# Altium project GameBoard_V1I1.PrjPcb (part 15 of 20)

## Sheet [24] - HEADERS, UART.SchDoc
size A2; DocumentNumber: 24; SheetNumber: 24; SheetTotal: 32
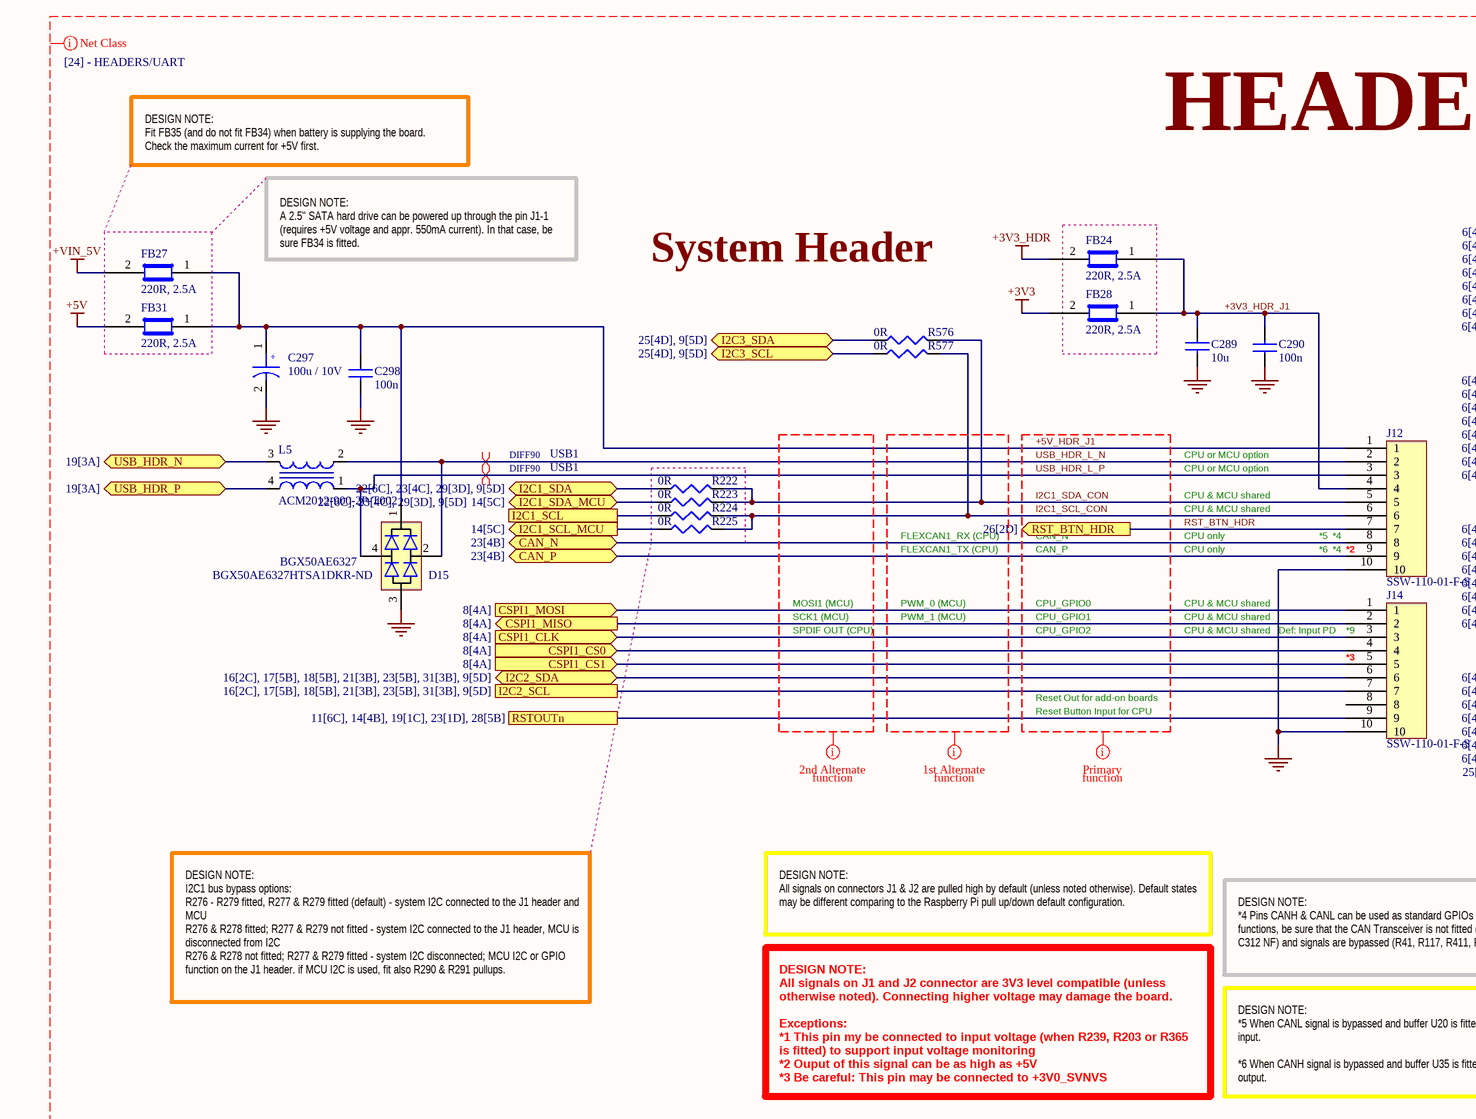
[diagram p78: [24] - HEADERS, UART.SchDoc, top left]
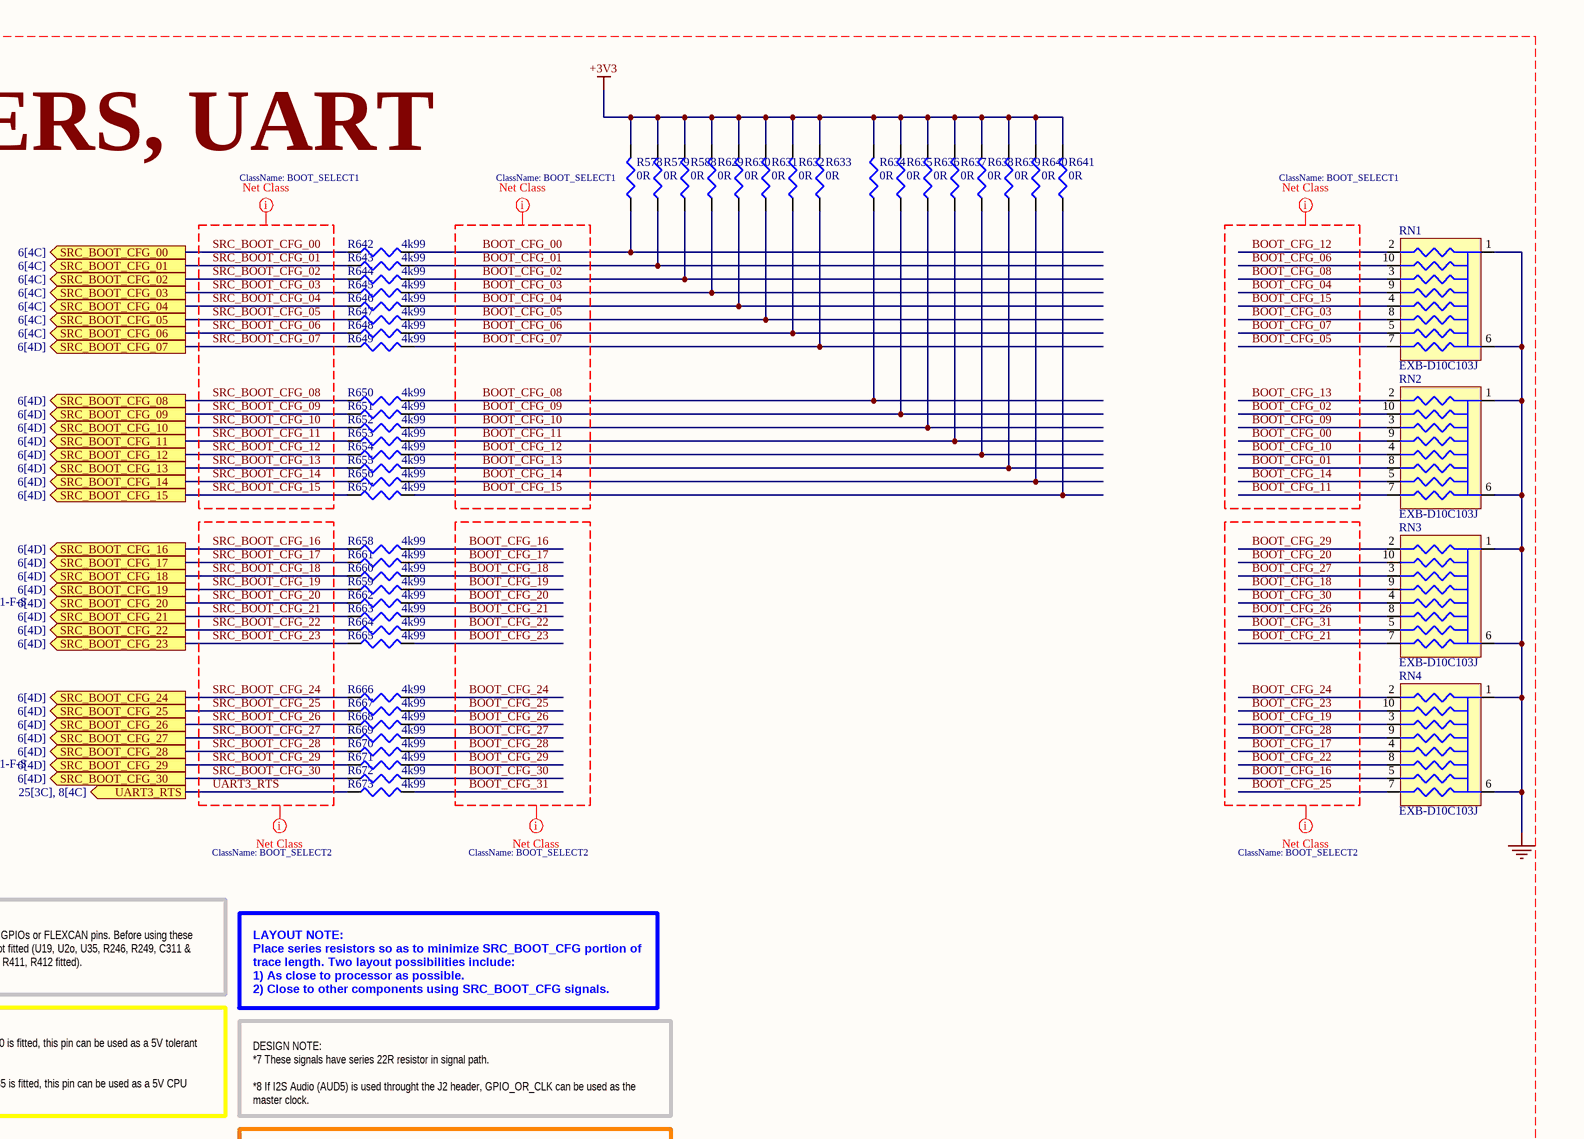
[diagram p79: [24] - HEADERS, UART.SchDoc, top right]
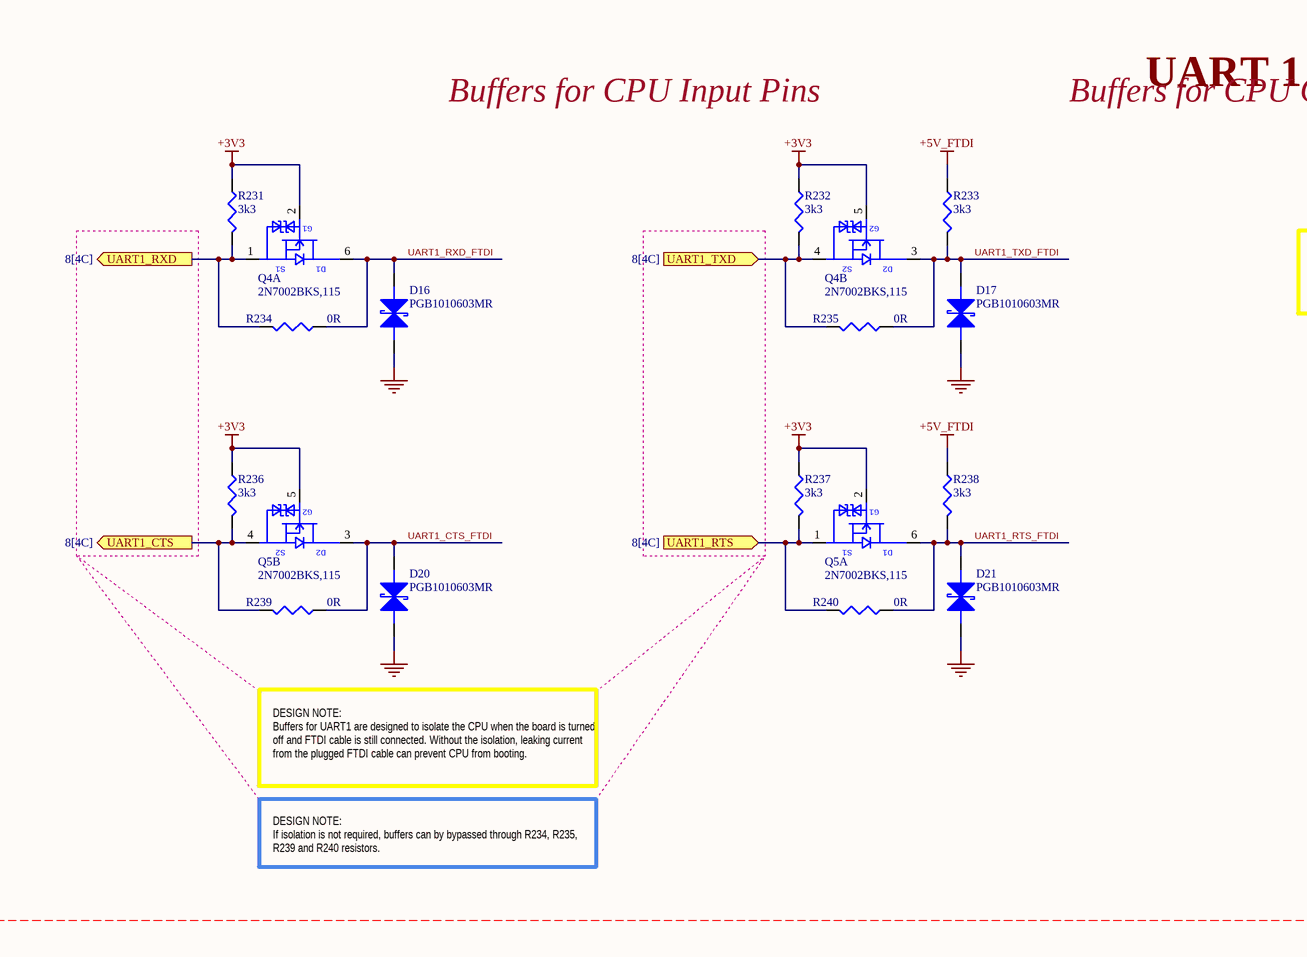
[diagram p80: [24] - HEADERS, UART.SchDoc, bottom left]
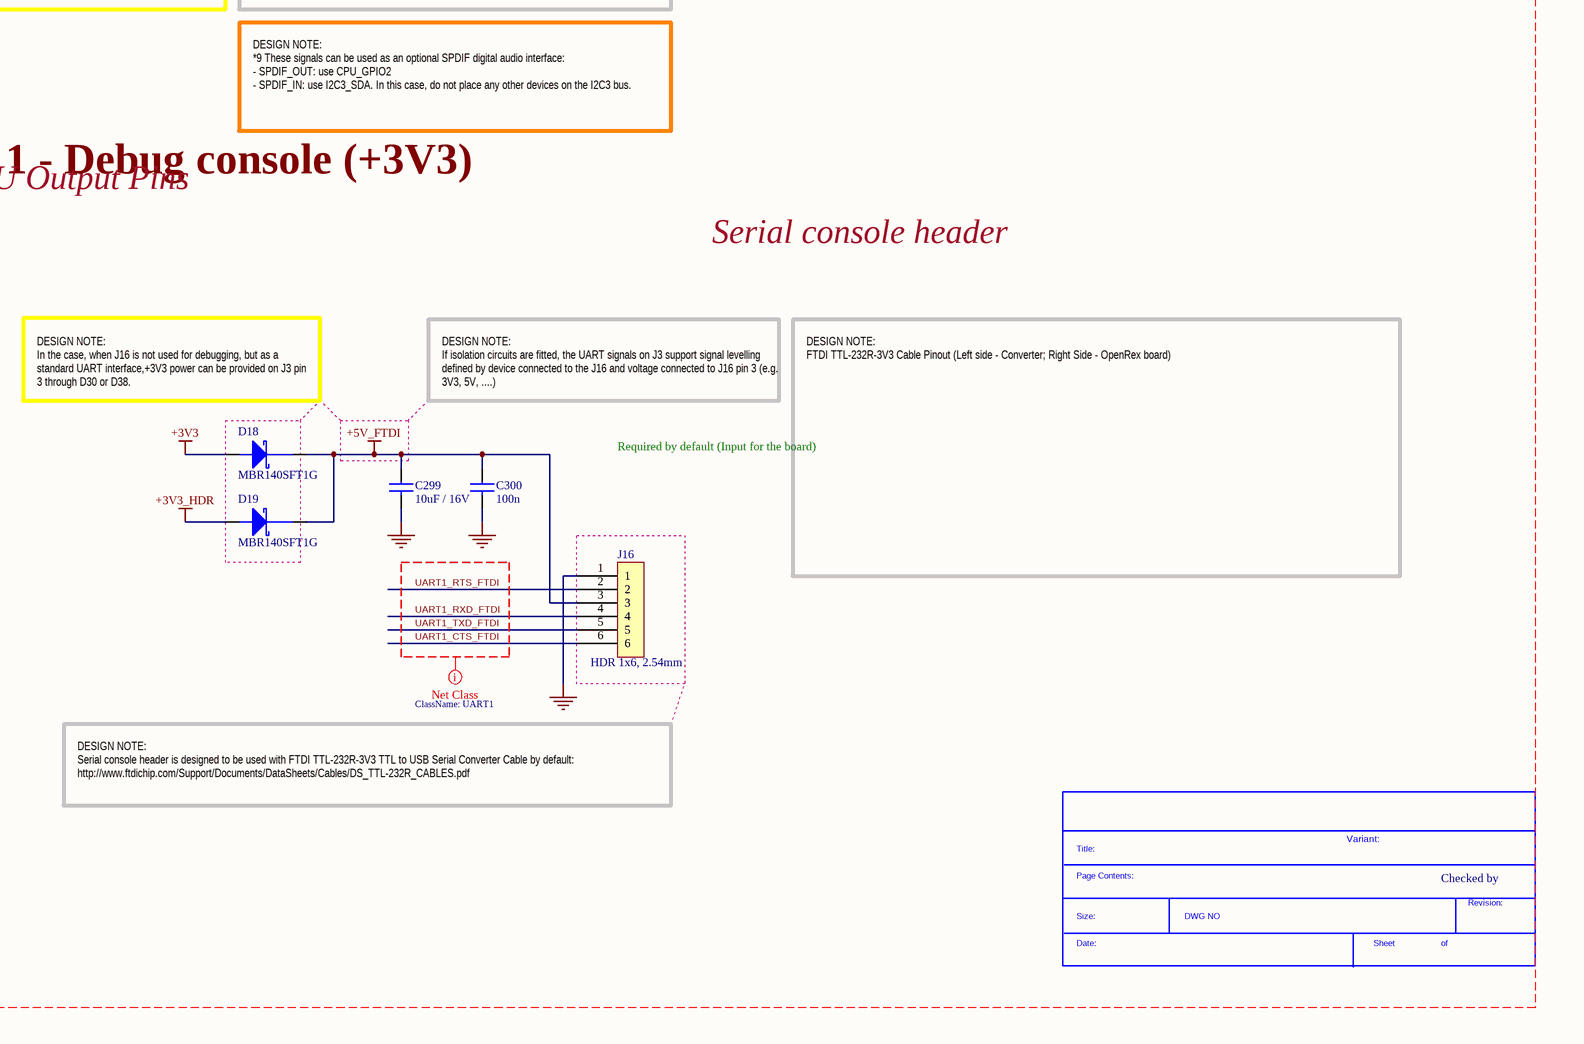
[diagram p81: [24] - HEADERS, UART.SchDoc, bottom right]

### Parts
(Parts that share a designator on the sheet are numbered #1, #2 ... from top to bottom, then left to right.)
*#27  SDTitleBlock  (value not drawn)  (graphical)
C289  10u  [C0603]
C290  100n  [C0402]
C297  100u / 10V  [C2312]
C298  100n  [C0402]
C299  10uF / 16V  [C0805]
C300  100n  [C0402]
D15  BGX50AE6327  Supplier Part Number 1: BGX50AE6327HTSA1DKR-ND  [SOT143]
D16  PGB1010603MR  [C0603]
D17  PGB1010603MR  [C0603]
D18  MBR140SFT1G  [SOD-123FL]
D19  MBR140SFT1G  [SOD-123FL]
D20  PGB1010603MR  [C0603]
D21  PGB1010603MR  [C0603]
FB24  220R, 2.5A  [C0603]
FB27  220R, 2.5A  [C0603]
FB28  220R, 2.5A  [C0603]
FB31  220R, 2.5A  [C0603]
J12  SSW-110-01-F-S  [SSW-110-01-F-S]
J14  SSW-110-01-F-S  [SSW-110-01-F-S]
J16  HDR 1x6, 2.54mm  [Hdr_1x6_2.54mm]
L5  ACM2012-900-2P-T002  [ACM2012]
Q4  2N7002BKS,115  [SOT363]  (parts A,B of 2)
Q5  2N7002BKS,115  [SOT363]  (parts A,B of 2)
R222  0R  [R0402]
R223  0R  [R0402]
R224  0R  [R0402]
R225  0R  [R0402]
R231  3k3  [R0402]
R232  3k3  [R0402]
R233  3k3  [R0402]
R234  0R  [R0402]
R235  0R  [R0402]
R236  3k3  [R0402]
R237  3k3  [R0402]
R238  3k3  [R0402]
R239  0R  [R0402]
R240  0R  [R0402]
R576  0R  [R0402]
R577  0R  [R0402]
R578  0R  [R0402]
R579  0R  [R0402]
R588  0R  [R0402]
R629  0R  [R0402]
R630  0R  [R0402]
R631  0R  [R0402]
R632  0R  [R0402]
R633  0R  [R0402]
R634  0R  [R0402]
R635  0R  [R0402]
R636  0R  [R0402]
R637  0R  [R0402]
R638  0R  [R0402]
R639  0R  [R0402]
R640  0R  [R0402]
R641  0R  [R0402]
R642  4k99  [R0201]
R643  4k99  [R0201]
R644  4k99  [R0201]
R645  4k99  [R0201]
R646  4k99  [R0201]
R647  4k99  [R0201]
R648  4k99  [R0201]
R649  4k99  [R0201]
R650  4k99  [R0201]
R651  4k99  [R0201]
R652  4k99  [R0201]
R653  4k99  [R0201]
R654  4k99  [R0201]
R655  4k99  [R0201]
R656  4k99  [R0201]
R657  4k99  [R0201]
R658  4k99  [R0201]
R659  4k99  [R0201]
R660  4k99  [R0201]
R661  4k99  [R0201]
R662  4k99  [R0201]
R663  4k99  [R0201]
R664  4k99  [R0201]
R665  4k99  [R0201]
R666  4k99  [R0201]
R667  4k99  [R0201]
R668  4k99  [R0201]
R669  4k99  [R0201]
R670  4k99  [R0201]
R671  4k99  [R0201]
R672  4k99  [R0201]
R673  4k99  [R0201]
RN1  EXB-D10C103J  [EXB-D10C103J]
RN2  EXB-D10C103J  [EXB-D10C103J]
RN3  EXB-D10C103J  [EXB-D10C103J]
RN4  EXB-D10C103J  [EXB-D10C103J]

### Ports
CAN_N (bidir, see 23[4B]), CAN_P (bidir, see 23[4B]), CSPI1_CLK (in, see 8[4A]), CSPI1_CS0 (in, see 8[4A]), CSPI1_CS1 (in, see 8[4A]), CSPI1_MISO (out, see 8[4A]), CSPI1_MOSI (in, see 8[4A]), I2C1_SCL (see 22[6C], 23[4C], 29[3D], 9[5D]), I2C1_SCL_MCU (out, see 14[5C]), I2C1_SDA (bidir, see 22[6C], 23[4C], 29[3D], 9[5D]), I2C1_SDA_MCU (bidir, see 14[5C]), I2C2_SCL (see 16[2C], 17[5B], 18[5B], 21[3B], 23[5B], 31[3B], 9[5D]), I2C2_SDA (bidir, see 16[2C], 17[5B], 18[5B], 21[3B], 23[5B], 31[3B], 9[5D]), I2C3_SCL (bidir, see 25[4D], 9[5D]), I2C3_SDA (bidir, see 25[4D], 9[5D]), RST_BTN_HDR (out, see 26[2D]), RSTOUTn (see 11[6C], 14[4B], 19[1C], 23[1D], 28[5B]), SRC_BOOT_CFG_00 (out, see 6[4C]), SRC_BOOT_CFG_01 (out, see 6[4C]), SRC_BOOT_CFG_02 (out, see 6[4C]), SRC_BOOT_CFG_03 (out, see 6[4C]), SRC_BOOT_CFG_04 (out, see 6[4C]), SRC_BOOT_CFG_05 (out, see 6[4C]), SRC_BOOT_CFG_06 (out, see 6[4C]), SRC_BOOT_CFG_07 (out, see 6[4D]), SRC_BOOT_CFG_08 (out, see 6[4D]), SRC_BOOT_CFG_09 (out, see 6[4D]), SRC_BOOT_CFG_10 (out, see 6[4D]), SRC_BOOT_CFG_11 (out, see 6[4D]), SRC_BOOT_CFG_12 (out, see 6[4D]), SRC_BOOT_CFG_13 (out, see 6[4D]), SRC_BOOT_CFG_14 (out, see 6[4D]), SRC_BOOT_CFG_15 (out, see 6[4D]), SRC_BOOT_CFG_16 (out, see 6[4D]), SRC_BOOT_CFG_17 (out, see 6[4D]), SRC_BOOT_CFG_18 (out, see 6[4D]), SRC_BOOT_CFG_19 (out, see 6[4D]), SRC_BOOT_CFG_20 (out, see 6[4D]), SRC_BOOT_CFG_21 (out, see 6[4D]), SRC_BOOT_CFG_22 (out, see 6[4D]), SRC_BOOT_CFG_23 (out, see 6[4D]), SRC_BOOT_CFG_24 (out, see 6[4D]), SRC_BOOT_CFG_25 (out, see 6[4D]), SRC_BOOT_CFG_26 (out, see 6[4D]), SRC_BOOT_CFG_27 (out, see 6[4D]), SRC_BOOT_CFG_28 (out, see 6[4D]), SRC_BOOT_CFG_29 (out, see 6[4D]), SRC_BOOT_CFG_30 (out, see 6[4D]), UART1_CTS (out, see 8[4C]), UART1_RTS (in, see 8[4C]), UART1_RXD (out, see 8[4C]), UART1_TXD (in, see 8[4C]), UART3_RTS (out, see 25[3C], 8[4C]), USB_HDR_N (bidir, see 19[3A]), USB_HDR_P (bidir, see 19[3A])

### Nets
+3V3: D18.2(Anode) FB28.2 Q4.2(GATE1) Q4.5(GATE2) Q5.2(GATE1) Q5.5(GATE2) R231.2 R232.2 R236.2 R237.2 R578.2 R579.2 R588.2 R629.2 R630.2 R631.2 R632.2 R633.2 R634.2 R635.2 R636.2 R637.2 R638.2 R639.2 R640.2 R641.2
+3V3_HDR: D19.2(Anode) FB24.2
+5V: FB31.2
+5V_FTDI: C299.1 C300.1 D18.1(Cathode) D19.1(Cathode) J16.3 R233.2 R238.2
+VIN_5V: FB27.2
GND: C289.2 C290.1 C297.2 C298.2 C299.2 C300.2 D15.3 D16.2 D17.2 D20.2 D21.2 J12.10 J14.10 J16.1 RN1.1 RN1.6 RN2.1 RN2.6 RN3.1 RN3.6 RN4.1 RN4.6
+3V3_HDR_J1: C289.1 C290.2 FB24.1 FB28.1 J12.4
+5V_HDR_J1: C297.1 C298.1 D15.1 FB27.1 FB31.1 J12.1
BOOT_CFG_00: R578.1 R642.2 RN2.9
BOOT_CFG_01: R579.1 R643.2 RN2.8
BOOT_CFG_02: R588.1 R644.2 RN2.10
BOOT_CFG_03: R629.1 R645.2 RN1.8
BOOT_CFG_04: R630.1 R646.2 RN1.9
BOOT_CFG_05: R631.1 R647.2 RN1.7
BOOT_CFG_06: R632.1 R648.2 RN1.10
BOOT_CFG_07: R633.1 R649.2 RN1.5
BOOT_CFG_08: R634.1 R650.2 RN1.3
BOOT_CFG_09: R635.1 R651.2 RN2.3
BOOT_CFG_10: R636.1 R652.2 RN2.4
BOOT_CFG_11: R637.1 R653.2 RN2.7
BOOT_CFG_12: R638.1 R654.2 RN1.2
BOOT_CFG_13: R639.1 R655.2 RN2.2
BOOT_CFG_14: R640.1 R656.2 RN2.5
BOOT_CFG_15: R641.1 R657.2 RN1.4
BOOT_CFG_16: R658.2 RN4.5
BOOT_CFG_17: R661.2 RN4.4
BOOT_CFG_18: R660.2 RN3.9
BOOT_CFG_19: R659.2 RN4.3
BOOT_CFG_20: R662.2 RN3.10
BOOT_CFG_21: R663.2 RN3.7
BOOT_CFG_22: R664.2 RN4.8
BOOT_CFG_23: R665.2 RN4.10
BOOT_CFG_24: R666.2 RN4.2
BOOT_CFG_25: R667.2 RN4.7
BOOT_CFG_26: R668.2 RN3.8
BOOT_CFG_27: R669.2 RN3.3
BOOT_CFG_28: R670.2 RN4.9
BOOT_CFG_29: R671.2 RN3.2
BOOT_CFG_30: R672.2 RN3.4
BOOT_CFG_31: R673.2 RN3.5
CAN_N: J12.8 ; port CAN_N
CAN_P: J12.9 ; port CAN_P
CSPI1_CLK: J14.3 ; port CSPI1_CLK
CSPI1_CS0: J14.4 ; port CSPI1_CS0
CSPI1_CS1: J14.5 ; port CSPI1_CS1
CSPI1_MISO: J14.2 ; port CSPI1_MISO
CSPI1_MOSI: J14.1 ; port CSPI1_MOSI
I2C1_SCL: R224.1 ; port I2C1_SCL
I2C1_SCL_CON: J12.6 R224.2 R225.2 R577.2
I2C1_SCL_MCU: R225.1 ; port I2C1_SCL_MCU
I2C1_SDA: R222.1 ; port I2C1_SDA
I2C1_SDA_CON: J12.5 R222.2 R223.2 R576.2
I2C1_SDA_MCU: R223.1 ; port I2C1_SDA_MCU
I2C2_SCL: J14.7 ; port I2C2_SCL
I2C2_SDA: J14.6 ; port I2C2_SDA
I2C3_SCL: R577.1 ; port I2C3_SCL
I2C3_SDA: R576.1 ; port I2C3_SDA
RST_BTN_HDR: J12.7 ; port RST_BTN_HDR
RSTOUTn: J14.9 ; port RSTOUTn
SRC_BOOT_CFG_00: R642.1 ; port SRC_BOOT_CFG_00
SRC_BOOT_CFG_01: R643.1 ; port SRC_BOOT_CFG_01
SRC_BOOT_CFG_02: R644.1 ; port SRC_BOOT_CFG_02
SRC_BOOT_CFG_03: R645.1 ; port SRC_BOOT_CFG_03
SRC_BOOT_CFG_04: R646.1 ; port SRC_BOOT_CFG_04
SRC_BOOT_CFG_05: R647.1 ; port SRC_BOOT_CFG_05
SRC_BOOT_CFG_06: R648.1 ; port SRC_BOOT_CFG_06
SRC_BOOT_CFG_07: R649.1 ; port SRC_BOOT_CFG_07
SRC_BOOT_CFG_08: R650.1 ; port SRC_BOOT_CFG_08
SRC_BOOT_CFG_09: R651.1 ; port SRC_BOOT_CFG_09
SRC_BOOT_CFG_10: R652.1 ; port SRC_BOOT_CFG_10
SRC_BOOT_CFG_11: R653.1 ; port SRC_BOOT_CFG_11
SRC_BOOT_CFG_12: R654.1 ; port SRC_BOOT_CFG_12
SRC_BOOT_CFG_13: R655.1 ; port SRC_BOOT_CFG_13
SRC_BOOT_CFG_14: R656.1 ; port SRC_BOOT_CFG_14
SRC_BOOT_CFG_15: R657.1 ; port SRC_BOOT_CFG_15
SRC_BOOT_CFG_16: R658.1 ; port SRC_BOOT_CFG_16
SRC_BOOT_CFG_17: R661.1 ; port SRC_BOOT_CFG_17
SRC_BOOT_CFG_18: R660.1 ; port SRC_BOOT_CFG_18
SRC_BOOT_CFG_19: R659.1 ; port SRC_BOOT_CFG_19
SRC_BOOT_CFG_20: R662.1 ; port SRC_BOOT_CFG_20
SRC_BOOT_CFG_21: R663.1 ; port SRC_BOOT_CFG_21
SRC_BOOT_CFG_22: R664.1 ; port SRC_BOOT_CFG_22
SRC_BOOT_CFG_23: R665.1 ; port SRC_BOOT_CFG_23
SRC_BOOT_CFG_24: R666.1 ; port SRC_BOOT_CFG_24
SRC_BOOT_CFG_25: R667.1 ; port SRC_BOOT_CFG_25
SRC_BOOT_CFG_26: R668.1 ; port SRC_BOOT_CFG_26
SRC_BOOT_CFG_27: R669.1 ; port SRC_BOOT_CFG_27
SRC_BOOT_CFG_28: R670.1 ; port SRC_BOOT_CFG_28
SRC_BOOT_CFG_29: R671.1 ; port SRC_BOOT_CFG_29
SRC_BOOT_CFG_30: R672.1 ; port SRC_BOOT_CFG_30
UART1_CTS: Q5.4(SOURCE2) R236.1 R239.1 ; port UART1_CTS
UART1_CTS_FTDI: D20.1 J16.6 Q5.3(DRAIN2) R239.2
UART1_RTS: Q5.1(SOURCE1) R237.1 R240.1 ; port UART1_RTS
UART1_RTS_FTDI: D21.1 J16.2 Q5.6(DRAIN1) R238.1 R240.2
UART1_RXD: Q4.1(SOURCE1) R231.1 R234.1 ; port UART1_RXD
UART1_RXD_FTDI: D16.1 J16.4 Q4.6(DRAIN1) R234.2
UART1_TXD: Q4.4(SOURCE2) R232.1 R235.1 ; port UART1_TXD
UART1_TXD_FTDI: D17.1 J16.5 Q4.3(DRAIN2) R233.1 R235.2
UART3_RTS: R673.1 ; port UART3_RTS
USB_HDR_L_N: D15.2 J12.2 L5.2
USB_HDR_L_P: D15.4 J12.3 L5.1
USB_HDR_N: L5.3 ; port USB_HDR_N
USB_HDR_P: L5.4 ; port USB_HDR_P

Not connected (* = marked no-connect by the designer): J14 8

### Layout directives
differential pair; net class DIFF90; net class USB1: USB_HDR_L_N, USB_HDR_L_P
mark named Primary: +5V_HDR_J1, I2C1_SCL_CON, I2C1_SDA_CON, USB_HDR_L_N, USB_HDR_L_P
mark named 1st Alternate: (no net found under the mark)
mark named 2nd Alternate: (no net found under the mark)
net class UART1: UART1_CTS_FTDI, UART1_RTS_FTDI, UART1_RXD_FTDI, UART1_TXD_FTDI
net class [24] - HEADERS/UART: +3V3, +3V3_HDR, +3V3_HDR_J1, +5V, +5V_FTDI, +5V_HDR_J1, +VIN_5V, BOOT_CFG_00, BOOT_CFG_01, BOOT_CFG_02, BOOT_CFG_03, BOOT_CFG_04, BOOT_CFG_05, BOOT_CFG_06, BOOT_CFG_07, BOOT_CFG_08, BOOT_CFG_09, BOOT_CFG_10, BOOT_CFG_11, BOOT_CFG_12, BOOT_CFG_13, BOOT_CFG_14, BOOT_CFG_15, BOOT_CFG_16, BOOT_CFG_17, BOOT_CFG_18, BOOT_CFG_19, BOOT_CFG_20, BOOT_CFG_21, BOOT_CFG_22, BOOT_CFG_23, BOOT_CFG_24, BOOT_CFG_25, BOOT_CFG_26, BOOT_CFG_27, BOOT_CFG_28, BOOT_CFG_29, BOOT_CFG_30, BOOT_CFG_31, GND, I2C1_SCL_CON, I2C1_SDA_CON, RST_BTN_HDR, SRC_BOOT_CFG_00, SRC_BOOT_CFG_01, SRC_BOOT_CFG_02, SRC_BOOT_CFG_03, SRC_BOOT_CFG_04, SRC_BOOT_CFG_05, SRC_BOOT_CFG_06, SRC_BOOT_CFG_07, SRC_BOOT_CFG_08, SRC_BOOT_CFG_09, SRC_BOOT_CFG_10, SRC_BOOT_CFG_11, SRC_BOOT_CFG_12, SRC_BOOT_CFG_13, SRC_BOOT_CFG_14, SRC_BOOT_CFG_15, SRC_BOOT_CFG_16, SRC_BOOT_CFG_17, SRC_BOOT_CFG_18, SRC_BOOT_CFG_19, SRC_BOOT_CFG_20, SRC_BOOT_CFG_21, SRC_BOOT_CFG_22, SRC_BOOT_CFG_23, SRC_BOOT_CFG_24, SRC_BOOT_CFG_25, SRC_BOOT_CFG_26, SRC_BOOT_CFG_27, SRC_BOOT_CFG_28, SRC_BOOT_CFG_29, SRC_BOOT_CFG_30, UART1_CTS_FTDI, UART1_RTS_FTDI, UART1_RXD_FTDI, UART1_TXD_FTDI, UART3_RTS, USB_HDR_L_N, USB_HDR_L_P
net class BOOT_SELECT1: BOOT_CFG_00, BOOT_CFG_01, BOOT_CFG_02, BOOT_CFG_03, BOOT_CFG_04, BOOT_CFG_05, BOOT_CFG_06, BOOT_CFG_07, BOOT_CFG_08, BOOT_CFG_09, BOOT_CFG_10, BOOT_CFG_11, BOOT_CFG_12, BOOT_CFG_13, BOOT_CFG_14, BOOT_CFG_15, SRC_BOOT_CFG_00, SRC_BOOT_CFG_01, SRC_BOOT_CFG_02, SRC_BOOT_CFG_03, SRC_BOOT_CFG_04, SRC_BOOT_CFG_05, SRC_BOOT_CFG_06, SRC_BOOT_CFG_07, SRC_BOOT_CFG_08, SRC_BOOT_CFG_09, SRC_BOOT_CFG_10, SRC_BOOT_CFG_11, SRC_BOOT_CFG_12, SRC_BOOT_CFG_13, SRC_BOOT_CFG_14, SRC_BOOT_CFG_15
net class BOOT_SELECT2: BOOT_CFG_16, BOOT_CFG_17, BOOT_CFG_18, BOOT_CFG_19, BOOT_CFG_20, BOOT_CFG_21, BOOT_CFG_22, BOOT_CFG_23, BOOT_CFG_24, BOOT_CFG_25, BOOT_CFG_26, BOOT_CFG_27, BOOT_CFG_28, BOOT_CFG_29, BOOT_CFG_30, BOOT_CFG_31, SRC_BOOT_CFG_16, SRC_BOOT_CFG_17, SRC_BOOT_CFG_18, SRC_BOOT_CFG_19, SRC_BOOT_CFG_20, SRC_BOOT_CFG_21, SRC_BOOT_CFG_22, SRC_BOOT_CFG_23, SRC_BOOT_CFG_24, SRC_BOOT_CFG_25, SRC_BOOT_CFG_26, SRC_BOOT_CFG_27, SRC_BOOT_CFG_28, SRC_BOOT_CFG_29, SRC_BOOT_CFG_30, UART3_RTS

### Notes on the sheet
- DESIGN NOTE:
  Fit FB35 (and do not fit FB34) when battery is supplying the board. Check the maximum current for +5V first.
- HEADERS, UART
- DESIGN NOTE:
  A 2.5" SATA hard drive can be powered up through the pin J1-1 (requires +5V voltage and appr. 550mA current). In that case, be sure FB34 is fitted.
- System Header
- CPU & MCU shared
- CPU or MCU option
- FLEXCAN1_TX (CPU)
- FLEXCAN1_RX (CPU)
- CAN_P
- CAN_N
- CPU only
- *5
- *6
- *4
- (near J12) *4
- (near J12) *2
- MOSI1 (MCU)
- SCK1 (MCU)
- SPDIF OUT (CPU)
- PWM_0 (MCU)
- PWM_1 (MCU)
- CPU_GPIO0
- CPU_GPIO1
- CPU_GPIO2
- (near J14) Def: Input PD
- (near J14) *9
- Reset Out for add-on boards
- (near J14) *3
- Reset Button Input for CPU
- function
- DESIGN NOTE:
  All signals on connectors J1 & J2 are pulled high by default (unless noted otherwise). Default states may be different comparing to the Raspberry Pi pull up/down default configuration.
- DESIGN NOTE:
  *4 Pins CANH & CANL can be used as standard GPIOs or FLEXCAN pins. Before using these functions, be sure that the CAN Transceiver is not fitted (U19, U2o, U35, R246, R249, C311 & C312 NF) and signals are bypassed (R41, R117, R411, R412 fitted).
- LAYOUT NOTE:
  Place series resistors so as to minimize SRC_BOOT_CFG portion of trace length. Two layout possibilities include:
  1) As close to processor as possible.
  2) Close to other components using SRC_BOOT_CFG signals.
- DESIGN NOTE:
  I2C1 bus bypass options:
  R276 - R279 fitted, R277 & R279 fitted (default) - system I2C connected to the J1 header and MCU
  R276 & R278 fitted; R277 & R279 not fitted - system I2C connected to the J1 header, MCU is disconnected from I2C
  R276 & R278 not fitted; R277 & R279 fitted - system I2C disconnected; MCU I2C or GPIO function on the J1 header. if MCU I2C is used, fit also R290 & R291 pullups.
- DESIGN NOTE:
  All signals on J1 and J2 connector are 3V3 level compatible (unless otherwise noted). Connecting higher voltage may damage the board.
  Exceptions:
  *1 This pin my be connected to input voltage (when R239, R203 or R365 is fitted) to support input voltage monitoring
  *2 Ouput of this signal can be as high as +5V
  *3 Be careful: This pin may be connected to +3V0_SVNVS
- DESIGN NOTE:
  *5 When CANL signal is bypassed and buffer U20 is fitted, this pin can be used as a 5V tolerant input.
  *6 When CANH signal is bypassed and buffer U35 is fitted, this pin can be used as a 5V CPU output.
- DESIGN NOTE:
  *7 These signals have series 22R resistor in signal path.
  *8 If I2S Audio (AUD5) is used throught the J2 header, GPIO_OR_CLK can be used as the master clock.
- DESIGN NOTE:
  *9 These signals can be used as an optional SPDIF digital audio interface:
  - SPDIF_OUT: use CPU_GPIO2
  - SPDIF_IN: use I2C3_SDA. In this case, do not place any other devices on the I2C3 bus.
- Buffers for CPU Input Pins
- Buffers for CPU Output Pins
- UART 1 - Debug console (+3V3)
- Serial console header
- DESIGN NOTE:
  In the case, when J16 is not used for debugging, but as a standard UART interface,+3V3 power can be provided on J3 pin 3 through D30 or D38.
- DESIGN NOTE:
  If isolation circuits are fitted, the UART signals on J3 support signal levelling defined by device connected to the J16 and voltage connected to J16 pin 3 (e.g. 3V3, 5V, ....)
- DESIGN NOTE:
  FTDI TTL-232R-3V3 Cable Pinout (Left side - Converter; Right Side - OpenRex board)
- Required by default (Input for the board)
- DESIGN NOTE:
  Serial console header is designed to be used with FTDI TTL-232R-3V3 TTL to USB Serial Converter Cable by default:
  http://www.ftdichip.com/Support/Documents/DataSheets/Cables/DS_TTL-232R_CABLES.pdf
- DESIGN NOTE:
  Buffers for UART1 are designed to isolate the CPU when the board is turned off and FTDI cable is still connected. Without the isolation, leaking current from the plugged FTDI cable can prevent CPU from booting.
- Variant:
- Checked by
- DESIGN NOTE:
  If isolation is not required, buffers can by bypassed through R234, R235, R239 and R240 resistors.
- (in symbol 2N7002BKS,115, part A) G1; S1; D1
- (in symbol 2N7002BKS,115, part B) G2; S2; D2
- (in symbol SDTitleBlock) Title:; Page Contents:; Revision:; Size:; DWG NO; Date:; Sheet; of
- (in symbol TPSC107K010R0150) +

### Library data of the parts
C289 = C1608X5R0J106M: as C268 on sheet [21] - AUDIO; Category: Capacitors; Supplier Part Number: 445-4112-1-ND; Manufacturer Part Number: C1608X5R0J106M; Operating Temperature: -55°C ~ 85°C; Package / Case: 0603 (1608 Metric); Price 1k [$]: 0.08580; .Checked SCH: used; Voltage - Rated: 6.3V; Features: Low ESR; Supplier: Digikey; Supplier 1: Digi-Key; Supplier Part Number 1: 445-4112-1-ND; RoHS: RoHS Compliant; Stock 1: 48157; Pricing 1: 1=0.46, 10=0.363, 100=0.1898, 250=0.14024, 500=0.1089, 1000=0.0858 (USD); Tolerance: ±20%; Temperature Coefficient: X5R; Mounting Type: Surface Mount, MLCC; Applications: General Purpose; Ratings: -; Size / Dimension: 0.063" L x 0.031" W (1.60mm x 0.80mm); Height - Seated (Max): -; Thickness (Max): 0.037" (0.95mm); Lead Spacing: -; Packaging: Cut Tape (CT); Lead Style: -; ComponentLink1URL: http://www.tdk.com/pdf/general_B11.pdf; ComponentLink1Description: http://www.tdk.com/pdf/general_B11.pdf
C290 C298 C300 = C1005X5R1H104K: as C218-C223 on sheet [16] - HDMI; Category: Capacitors; Supplier Part Number: 445-5942-1-ND; Manufacturer Part Number: C1005X5R1H104K; Operating Temperature: -55°C ~ 85°C; Package / Case: 0402 (1005 Metric); Price 1k [$]: 0.02340; .Checked SCH: used; Voltage - Rated: 50V; Supplier: Digikey; Supplier 1: Digi-Key; Supplier Part Number 1: 445-5942-1-ND; RoHS: RoHS Compliant; Stock 1: 106926; Pricing 1: 1=0.27, 10=0.18, 100=0.072, 250=0.05176, 500=0.0369, 1000=0.027 (USD); Tolerance: ±10%; Temperature Coefficient: X5R; Mounting Type: Surface Mount, MLCC; Applications: General Purpose; Ratings: -; Size / Dimension: 0.039" L x 0.020" W (1.00mm x 0.50mm); Height - Seated (Max): -; Thickness (Max): 0.022" (0.55mm); Lead Spacing: -; Features: -; Packaging: Cut Tape (CT); Lead Style: -; ComponentLink1URL: http://www.tdk.co.jp/tefe02/e412_c.pdf; ComponentLink1Description: http://www.tdk.co.jp/tefe02/e412_c.pdf; Supplier 2: Digi-Key; Supplier Part Number 2: 311-1697-6-ND
C297 = TPSC107K010R0150: CAP TANT 100UF 10V 10% 2312; Manufacturer: AVX Corporation; Manufacturer Size Code: C; Capacitance: 100µF; ESR (Equivalent Series Resistance): 150 mOhm; Type: Molded; .Creator: MM; .Checked PCB: used; Supplier 1: Digi-Key; Manufacturer Part Number: TPSC107K010R0150; RoHS: RoHS Compliant; Category: Capacitors; Stock 1: 3211; Pricing 1: 1=1, 10=0.85, 100=0.4969, 250=0.4168 (USD); Packaging: Cut Tape (CT); Tolerance: ±10%; Voltage - Rated: 10V; Operating Temperature: -55°C ~ 125°C; Mounting Type: Surface Mount; Package / Case: 2312 (6032 Metric); Size / Dimension: 0.236" L x 0.126" W (6.00mm x 3.20mm); Height - Seated (Max): 0.110" (2.80mm); Lead Spacing: -; Features: General Purpose; Lifetime @ Temp.: -; ComponentLink1URL: http://www.avx.com/docs/Catalogs/tps.pdf; ComponentLink1Description: http://www.avx.com/docs/Catalogs/tps.pdf; Supplier Part Number 1: 478-7995-1-ND; .Checked SCH: used
C299 = C2012X5R1C106M: CAP CER 10UF 16V 20% X5R 0805; Manufacturer: TDK Corporation; Manufacturer Part Number: C2012X5R1C106M/1.25; Capacitance: 10µF; .Checked PCB: used; Supplier 1: Digi-Key; Supplier Part Number 1: 445-5984-1-ND; RoHS: RoHS Compliant; Category: Capacitors; Voltage - Rated: 16V; Tolerance: ±20%; Temperature Coefficient: X5R; Mounting Type: Surface Mount, MLCC; Operating Temperature: -55°C ~ 85°C; Applications: General Purpose; Ratings: -; Package / Case: 0805 (2012 Metric); Size / Dimension: 0.079" L x 0.049" W (2.00mm x 1.25mm); Height - Seated (Max): -; Thickness (Max): 0.039" (1.00mm); Lead Spacing: -; Features: -; Packaging: Cut Tape (CT); Lead Style: -; ComponentLink1URL: http://www.tdk.com/pdf/general_B11.pdf; ComponentLink1Description: http://www.tdk.com/pdf/general_B11.pdf; .Checked SCH: used; Supplier 2: Digi-Key; Supplier Part Number 2: 478-10492-1-ND
D15 = BGX50AE6327: DIODE SWITCHING 50V SOT-143; Manufacturer: Infineon Technologies; .Checked PCB: used; Current - DC Forward (If): 140mA; Diode Type: Single Phase; Speed: Small Signal =< 200mA (Io), Any Speed; Reverse Recovery Time (trr): 6ns; Max Repetitive Reverse Voltage (Vrrm): 70V; Forward Voltage: 1.3V; Peak Reverse Current: 100uA; Max Power Dissipation: 210mW; .Checked SCH: used; Category: Discrete Semiconductor Products; Family: Bridge Rectifiers; Manufacturer Part Number: BGX50AE6327; Package / Case: TO-253-4, TO-253AA; Price 1k [$]: 0.10013; Supplier: Digikey; Supplier Part Number: BGX50AINCT-ND; Value: BGX50AE6327; Supplier 1: Digi-Key; RoHS: RoHS Compliant; Stock 1: 0; Pricing 1: 1=0.39, 10=0.294, 100=0.1829, 500=0.12514, 1000=0.09626 (USD); Voltage - Peak Reverse (Max): 50V; Mounting Type: Surface Mount; Packaging: Cut Tape (CT); Supplier Device Package: PG-SOT143-4; ComponentLink1URL: http://www.infineon.com/dgdl/bgx50aseries.pdf?folderId=db3a30431400ef6801141cc1c4cd04e8&fileId=db3a30431400ef6801141cc423c404e9; ComponentLink1Description: http://www.infineon.com/dgdl/bgx50aseries.pdf?folderId=db3a30431400ef6801141cc1c4cd04e8&fileId=db3a30431400ef6801141cc423c404e9; Mount: Surface Mount; Case/Package: SOT-143-4; Number of Pins: 4; Contact Plating: Matte,Tin; Min Operating Temperature: -65°C; Max Operating Temperature: 150°C; Forward Current: 140mA; Reverse Recovery Time: 6ns; Recovery Time: 6ns; Package Quantity: 3000; Length: 2.9mm; Height: 1mm; Width: 1.3mm
D16 D17 D20 D21 = PGB1010603MR: SUPPRESSOR ESD 24VDC 0603 SMD; Manufacturer: Littelfuse Inc; Voltage - Reverse Standoff (Typ): 24V; Polarization: Bidirectional; .Creator: MM; .Checked PCB: used; Supplier 1: Digi-Key; Manufacturer Part Number: PGB1010603MR; RoHS: RoHS Compliant; Category: Circuit Protection; Stock 1: 155406; Pricing 1: 1=0.66, 10=0.556, 25=0.4872, 100=0.4172, 250=0.3618, 500=0.30646 (USD); Packaging: Cut Tape (CT); Voltage - Breakdown: -; Power (Watts): -; Mounting Type: Surface Mount; Package / Case: 0603 (1608 Metric); Supplier Device Package: 0603 (1608 Metric); ComponentLink1URL: http://www.littelfuse.com/data/en/Data_Sheets/Littelfuse_PulseGuard-ESD_PGB1.pdf; ComponentLink1Description: http://www.littelfuse.com/data/en/Data_Sheets/Littelfuse_PulseGuard-ESD_PGB1.pdf; Supplier Part Number 1: F2594CT-ND; .Checked SCH: used
D18 D19 = MBR140SFT1G: DIODE SCHOTTKY 40V 1A SOD123L; Manufacturer: ON Semiconductor; Voltage - Forward (Vf) (Max) @ If: 550mV @ 1A; Speed: Fast Recovery =< 500ns, > 200mA (Io); Current - Reverse Leakage @ Vr: 500µA @ 40V; .Creator: MM; .Checked PCB: used; Supplier 1: Digi-Key; Manufacturer Part Number: MBR140SFT1G; RoHS: RoHS Compliant; Category: Discrete Semiconductor Products; Stock 1: 9727; Pricing 1: 1=0.47, 10=0.333, 25=0.274, 100=0.2188, 250=0.1594, 500=0.12944, 1000=0.0995 (USD); Packaging: Cut Tape (CT); Diode Type: Schottky; Voltage - DC Reverse (Vr) (Max): 40V; Current - Average Rectified (Io): 1A; Reverse Recovery Time (trr): -; Capacitance @ Vr, F: -; Mounting Type: Surface Mount; Package / Case: SOD-123F; Supplier Device Package: SOD-123L; Operating Temperature - Junction: -55°C ~ 125°C; ComponentLink1URL: http://www.onsemi.com/pub_link/Collateral/MBR140SFT1-D.PDF; ComponentLink1Description: http://www.onsemi.com/pub_link/Collateral/MBR140SFT1-D.PDF; Supplier Part Number 1: MBR140SFT1GOSCT-ND; .Checked SCH: used
FB24 FB27 FB28 FB31 = BLM18SG221TN1D: FERRITE CHIP 220 OHM 2500MA 0603; Manufacturer: Murata Electronics North America; Impedance @ Frequency: 220 Ohm @ 100MHz; DC Resistance (DCR): 40 mOhm Max; Filter Type: Differential Mode - Single; Number of Lines: 1; .Checked PCB: used; Supplier 1: Digi-Key; Supplier Part Number 1: 490-5225-1-ND; Manufacturer Part Number: BLM18SG221TN1D; RoHS: RoHS Compliant; Category: Filters; Stock 1: 54640; Pricing 1: 1=0.38, 10=0.282, 50=0.1646, 100=0.1316, 250=0.094, 500=0.06392, 1000=0.0517, 5000=0.04042 (USD); Current Rating: 2.5A; Package / Case: 0603 (1608 Metric); Mounting Type: Surface Mount; Packaging: Cut Tape (CT); Height (Max): 0.037" (0.95mm); Size / Dimension: 0.063" L x 0.031" W (1.60mm x 0.80mm); ComponentLink1URL: http://search.murata.co.jp/Ceramy/image/img/PDF/ENG/L0110S0100BLM18S.pdf; ComponentLink1Description: http://search.murata.co.jp/Ceramy/image/img/PDF/ENG/L0110S0100BLM18S.pdf; .Checked SCH: used
J12 J14 = SSW-110-01-F-S: CONN RCPT 10POS .100" DUAL GOLD; Manufacturer: Samtec; Number of Contacts: 10; Gender: Female; Mating Cycles: 100; Max Current Rating: 6.9A; Contact Resistance: 10mR; Max Voltage Rating (AC): 550V; Pitch: 2.54mm; .Creator: MB; Supplier 1: Digi-Key; Manufacturer Part Number: SSW-110-01-F-S; Stock 1: 1320; Pricing 1: 1=1.49, 10=1.237, 100=0.916, 500=0.7328, 1000=0.6641, 5000=0.58395, 10000=0.5725 (USD); Contact Plating: Nickel,Gold; Colour: Black; Contact Material: Bronze; Housing Colour: Black; Housing Material: Polymer; Min Operating Temperature: -55°C; Max Operating Temperature: 125°C; Number of Rows: 1; Termination: Solder; Packaging: Bulk; Orientation: Straight; Length: 25.91mm; Depth: 2.41mm; Radiation Hardening: No; ComponentLink1URL: http://components.arrow.com/part/dataview/0323_01321048; ComponentLink1Description: http://components.arrow.com/part/dataview/0323_01321048; ComponentLink2URL: ftp://ftp.samtec.com/webfiles/PDF/SSQ_TH.PDF; ComponentLink2Description: ftp://ftp.samtec.com/webfiles/PDF/SSQ_TH.PDF; Supplier Part Number 1: SAM10029-ND; .Checked SCH: *; .Checked PCB: *
J16 = 68001-206HLF: CONN HEADER 6POS .100 STR 15AU; Manufacturer: FCI; Connector Type: Header, Unshrouded; Number of Positions: 6; Number of Positions Loaded: All; Pitch: 0.100" (2.54mm); .Creator: MM; .Checked PCB: used; Supplier 1: Digi-Key; Manufacturer Part Number: 68001-206HLF; RoHS: RoHS Compliant; Category: Connectors, Interconnects; Stock 1: 2198; Pricing 1: 1=0.44, 10=0.412, 25=0.3704, 50=0.3292, 100=0.3156, 250=0.28812, 500=0.2744, 1000=0.22638, 2500=0.2058 (USD); Packaging: Bulk; Contact Type: Male Pin; Number of Rows: 1; Row Spacing: -; Contact Mating Length: 0.230" (5.84mm); Mounting Type: Through Hole; Termination: Solder; Fastening Type: -; Features: -; Contact Finish: Gold; Contact Finish Thickness: 15µin (0.38µm); Color: Black; ComponentLink1URL: http://portal.fciconnect.com/Comergent//fci/drawing/68000.pdf; ComponentLink1Description: http://portal.fciconnect.com/Comergent//fci/drawing/68000.pdf; Supplier Part Number 1: 609-3403-ND; .Checked SCH: used
L5 = ACM2012-900-2P-T002: CHOKE COMM MODE 90 OHM .4A SMD; Manufacturer: TDK Corporation; Filter Type: Data, Signal Line; Number of Lines: 2; Current: 400mA; DC Resistance (DCR): 190 mOhm Max; Impedance: 90 Ohm; Resistance (Ohms): 8.2K; Power (Watts): 0.063W, 1/16W; Temperature Coefficient: ±100ppm/°C; Tolerance: ±1%; .Checked PCB: used; Supplier 1: Digi-Key; Supplier Part Number 1: 445-2207-1-ND; Manufacturer Part Number: ACM2012-900-2P-T002; RoHS: RoHS Compliant; Category: Filters; Stock 1: 175768; Pricing 1: 1=0.48, 10=0.448, 50=0.42, 100=0.364, 500=0.308, 1000=0.252 (USD); Inductance: -; Mounting Type: Surface Mount; Size / Dimension: 0.079" L x 0.047" W (2.00mm x 1.20mm); Height (Max): 0.051" (1.30mm); Package / Case: 0805 (2012 Metric), 4 Lead; Operating Temperature: -25°C ~ 85°C; Packaging: Cut Tape (CT); ComponentLink1URL: http://www.tdk.co.jp/tefe02/e9719_acm2012.pdf; ComponentLink1Description: http://www.tdk.co.jp/tefe02/e9719_acm2012.pdf; Composition: Thick Film; Features: -; Height: 0.016" (0.40mm); Number of Terminations: 2; ComponentLink2URL: http://www.yageo.com/documents/recent/PYu-RC0402_51_RoHS_L_6.pdf; ComponentLink2Description: http://www.yageo.com/documents/recent/PYu-RC0402_51_RoHS_L_6.pdf; .Checked SCH: used; Supplier 2: Digi-Key; Supplier Part Number 2: SRF2012-900YACT-ND
Q4 Q5 = 2N7002BKS,115: MOSFET 2N-CH 60V 0.3A 6TSSOP; Manufacturer: NXP Semiconductors; FET Type: 2 N-Channel (Dual); FET Feature: Logic Level Gate; Current - Continuous Drain (Id) @ 25°C: 300mA; Rds On (Max) @ Id, Vgs: 1.6 Ohm @ 500mA, 10V; Vgs(th) (Max) @ Id: 2.1V @ 250µA; Gate Charge (Qg) @ Vgs: 0.6nC @ 4.5V; Input Capacitance (Ciss) @ Vds: 50pF @ 10V; Power - Max: 295mW; .Creator: MM; .Checked SCH: used; Supplier 1: Digi-Key; Manufacturer Part Number: 2N7002BKS,115; RoHS: RoHS Compliant; Category: Discrete Semiconductor Products; Stock 1: 34098; Pricing 1: 1=0.54, 10=0.389, 25=0.3028, 100=0.2293, 250=0.16212, 500=0.12978, 1000=0.09954 (USD); Packaging: Cut Tape (CT); Drain to Source Voltage (Vdss): 60V; Mounting Type: Surface Mount; Package / Case: 6-TSSOP, SC-88, SOT-363; Supplier Device Package: 6-TSSOP; ComponentLink1URL: http://www.nxp.com/documents/data_sheet/2N7002BKS.pdf; ComponentLink1Description: http://www.nxp.com/documents/data_sheet/2N7002BKS.pdf; Supplier Part Number 1: 568-5977-1-ND; .Checked PCB: used; Referenced footrpint used by MM: http://www.diodes.com/_files/datasheets/ap02001.pdf; Supplier 2: Digi-Key; Supplier Part Number 2: 1727-4786-6-ND
R222-R225 R234 R235 R239 R240 R576-R579 R588 R629-R641 = RC0402JR-070RL: as R141-R144 on sheet [16] - HDMI; Category: Resistors; Supplier Part Number: 311-0.0JRCT-ND; Manufacturer Part Number: RC0402JR-070RL; Package / Case: 0402 (1005 Metric); Price 1k [$]: 0.01389; Value: 0R; .Checked SCH: used; Supplier: Digikey; Supplier 1: Digi-Key; Supplier Part Number 1: 311-0.0JRCT-ND; RoHS: RoHS Compliant; Stock 1: 1106330; Pricing 1: 10=0.012, 50=0.009, 100=0.0069, 250=0.00512, 500=0.0038, 1000=0.00253 (USD); Composition: Thick Film; Features: -; Temperature Coefficient: -; Size / Dimension: 0.039" L x 0.020" W (1.00mm x 0.50mm); Height: 0.016" (0.40mm); Number of Terminations: 2; Packaging: Cut Tape (CT); ComponentLink1URL: http://www.yageo.com/documents/recent/PYu-RC0402_51_RoHS_L_6.pdf; ComponentLink1Description: http://www.yageo.com/documents/recent/PYu-RC0402_51_RoHS_L_6.pdf
R231-R233 R236-R238 = RC0402FR-073K3L: RES 3.30K OHM 1/16W 1% 0402 SMD; Manufacturer: Yageo; Resistance (Ohms): 3.3K; Power (Watts): 0.063W, 1/16W; .Checked PCB: used; Temperature Coefficient: ±100ppm/°C; Category: Resistors; Supplier Part Number: 311-3.30KLRCT-ND; Manufacturer Part Number: RC0402FR-073K3L; Package / Case: 0402 (1005 Metric); Price 1k [$]: 0.01421; Tolerance: ±1%; Value: 3k3; .Checked SCH: used; Supplier: Digikey; Supplier 1: Digi-Key; Supplier Part Number 1: 311-3.30KLRCT-ND; RoHS: RoHS Compliant; Stock 1: 356340; Pricing 1: 10=0.014, 50=0.0104, 100=0.0079, 250=0.00584, 500=0.00432, 1000=0.00288 (USD); Composition: Thick Film; Features: -; Size / Dimension: 0.039" L x 0.020" W (1.00mm x 0.50mm); Height: 0.016" (0.40mm); Number of Terminations: 2; Packaging: Cut Tape (CT); ComponentLink1URL: http://www.yageo.com/documents/recent/PYu-RC0402_51_RoHS_L_6.pdf; ComponentLink1Description: http://www.yageo.com/documents/recent/PYu-RC0402_51_RoHS_L_6.pdf
R642-R673 = RMCF0201FT4K99: RES 4.99K OHM 1/20W 1% 0201; Manufacturer: Stackpole Electronics Inc; Power (Watts): 0.05W, 1/20W; Temperature Coefficient: ±200ppm/°C; .Creator: MM; .Checked PCB: used; Supplier 1: Digi-Key; Manufacturer Part Number: RMCF0201FT4K99; RoHS: RoHS Compliant; Category: Resistors; Stock 1: 28120; Pricing 1: 1=0.11, 10=0.074, 50=0.0402, 100=0.0306, 250=0.02276, 500=0.0168, 1000=0.0112, 2500=0.00945, 5000=0.00788 (USD); Packaging: Cut Tape (CT); Resistance (Ohms): 4.99k; Tolerance: ±1%; Composition: Thick Film; Features: -; Package / Case: 0201 (0603 Metric); Supplier Device Package: 0201; Size / Dimension: 0.024" L x 0.012" W (0.60mm x 0.30mm); Height: 0.009" (0.24mm); Number of Terminations: 2; ComponentLink1URL: http://www.seielect.com/Catalog/SEI-RMCF_RMCP.pdf; ComponentLink1Description: http://www.seielect.com/Catalog/SEI-RMCF_RMCP.pdf; Supplier Part Number 1: RMCF0201FT4K99CT-ND; .Checked SCH: used
RN1-RN4 = EXB-D10C103J: RES ARRAY 10k 8pos 10pin; Manufacturer: Panasonic; Resistance: 10kR; Number of Resistors: 8; Temperature Coefficient: 200ppm/°C; Tolerance: 5%; Voltage Rating: 25V; Circuit Type: Bussed; Power Per Element: 50mW; Number of Contacts: 10; Voltage Rating (DC): 50V; .Creator: MB; Supplier 1: Digi-Key; Manufacturer Part Number: EXB-D10C103J; Stock 1: 78527; Pricing 1: 1=0.49, 10=0.376, 25=0.286, 50=0.2124, 100=0.1579, 250=0.1334, 500=0.11434, 1000=0.08712 (USD); Mount: Surface Mount; Case/Package: 1206; Number of Pins: 10; Number of Terminals: 10; Case Code (Metric): 3216; Case Code (Imperial): 1206; Contact Plating: Tin; Min Operating Temperature: -55°C; Max Operating Temperature: 125°C; Package Quantity: 1; Packaging: Tape and Reel; Number of Elements: 8; Termination: Concave; Military Standard: Not; Power Dissipation: 50mW; Length: 3.2mm; Height: 0.026inch; Width: 1.6mm; Terminal Pitch: 0.64mm; Depth: 1.6mm; Radiation Hardening: No; REACH SVHC: Unknown; Lead Free: Lead Free; ComponentLink1URL: https://datasheet.ciiva.com/3265/aoc0000ce3-3265173.pdf; ComponentLink1Description: https://datasheet.ciiva.com/3265/aoc0000ce3-3265173.pdf; ComponentLink2URL: https://datasheet.ciiva.com/26913/getdatasheetpartid-253339-26913798.pdf; ComponentLink2Description: https://datasheet.ciiva.com/26913/getdatasheetpartid-253339-26913798.pdf; ComponentLink3URL: https://datasheet.ciiva.com/28418/1790634-28418905.pdf; ComponentLink3Description: https://datasheet.ciiva.com/28418/1790634-28418905.pdf; ComponentLink4URL: https://datasheet.ciiva.com/8054/1790634-8054650.pdf; ComponentLink4Description: https://datasheet.ciiva.com/8054/1790634-8054650.pdf; ComponentLink5URL: https://datasheet.ciiva.com/3263/aoc0000ce3-3263821.pdf; ComponentLink5Description: https://datasheet.ciiva.com/3263/aoc0000ce3-3263821.pdf; ComponentLink6URL: https://datasheet.ciiva.com/16964/aoc0000ce3-16964031.pdf; ComponentLink6Description: https://datasheet.ciiva.com/16964/aoc0000ce3-16964031.pdf; Supplier Part Number 1: U9103CT-ND; .Checked SCH: *; .Checked PCB: *